# EAGLE schematic OpenDeck-r1 (EAGLE 6.5.0)
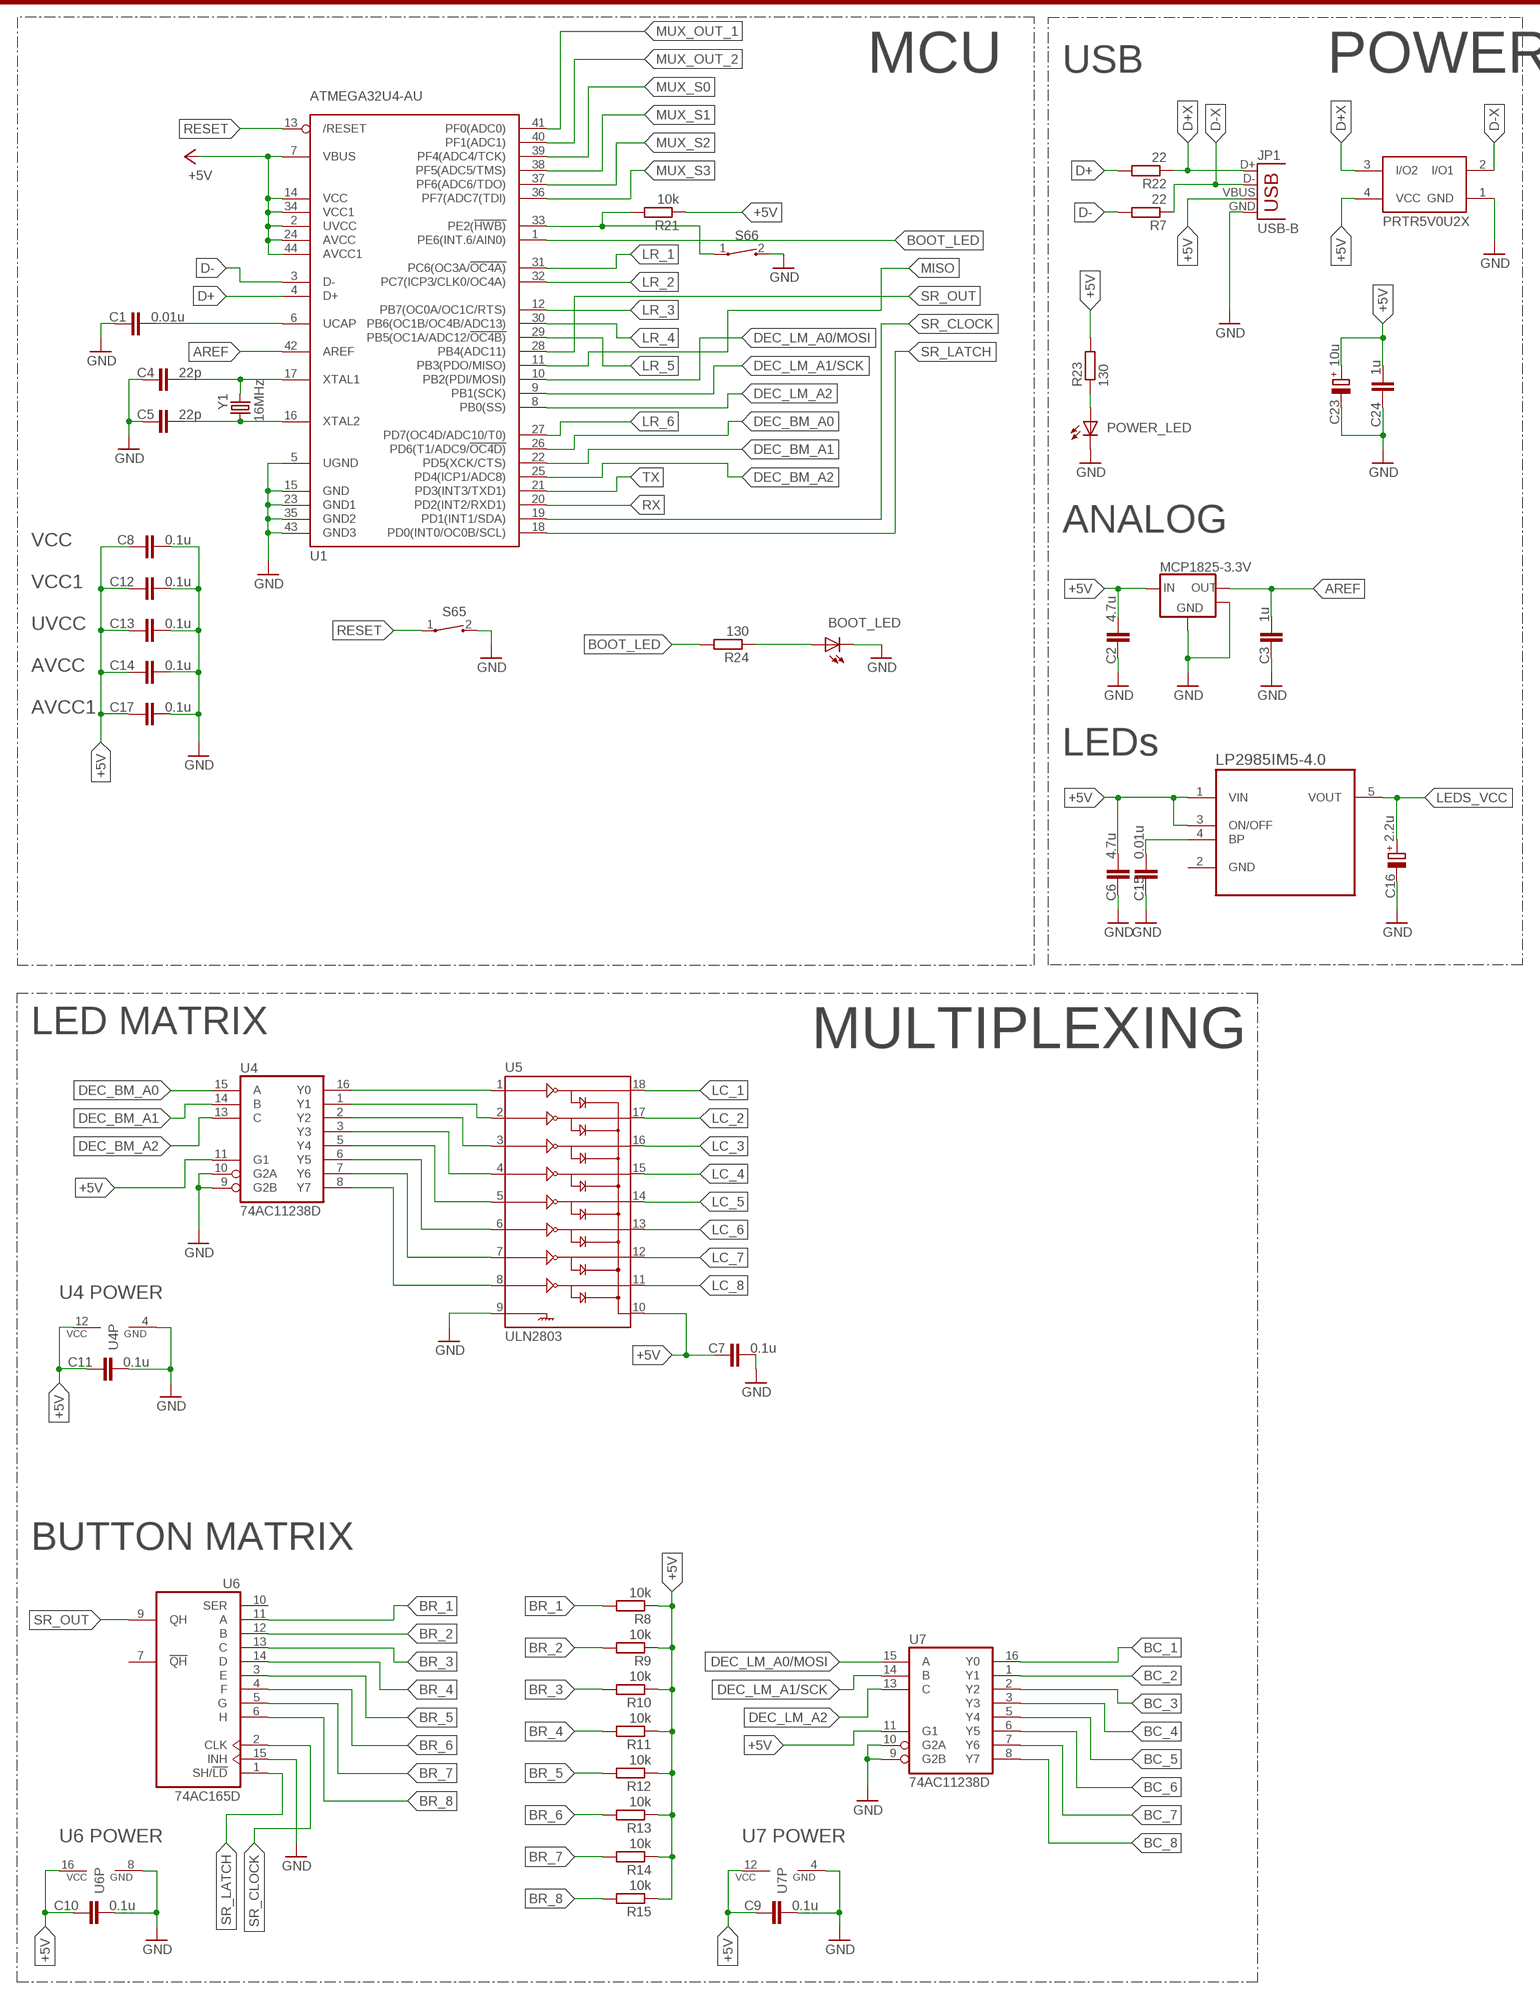
[diagram p0: schematic, sheet 1, part 1 of 2]
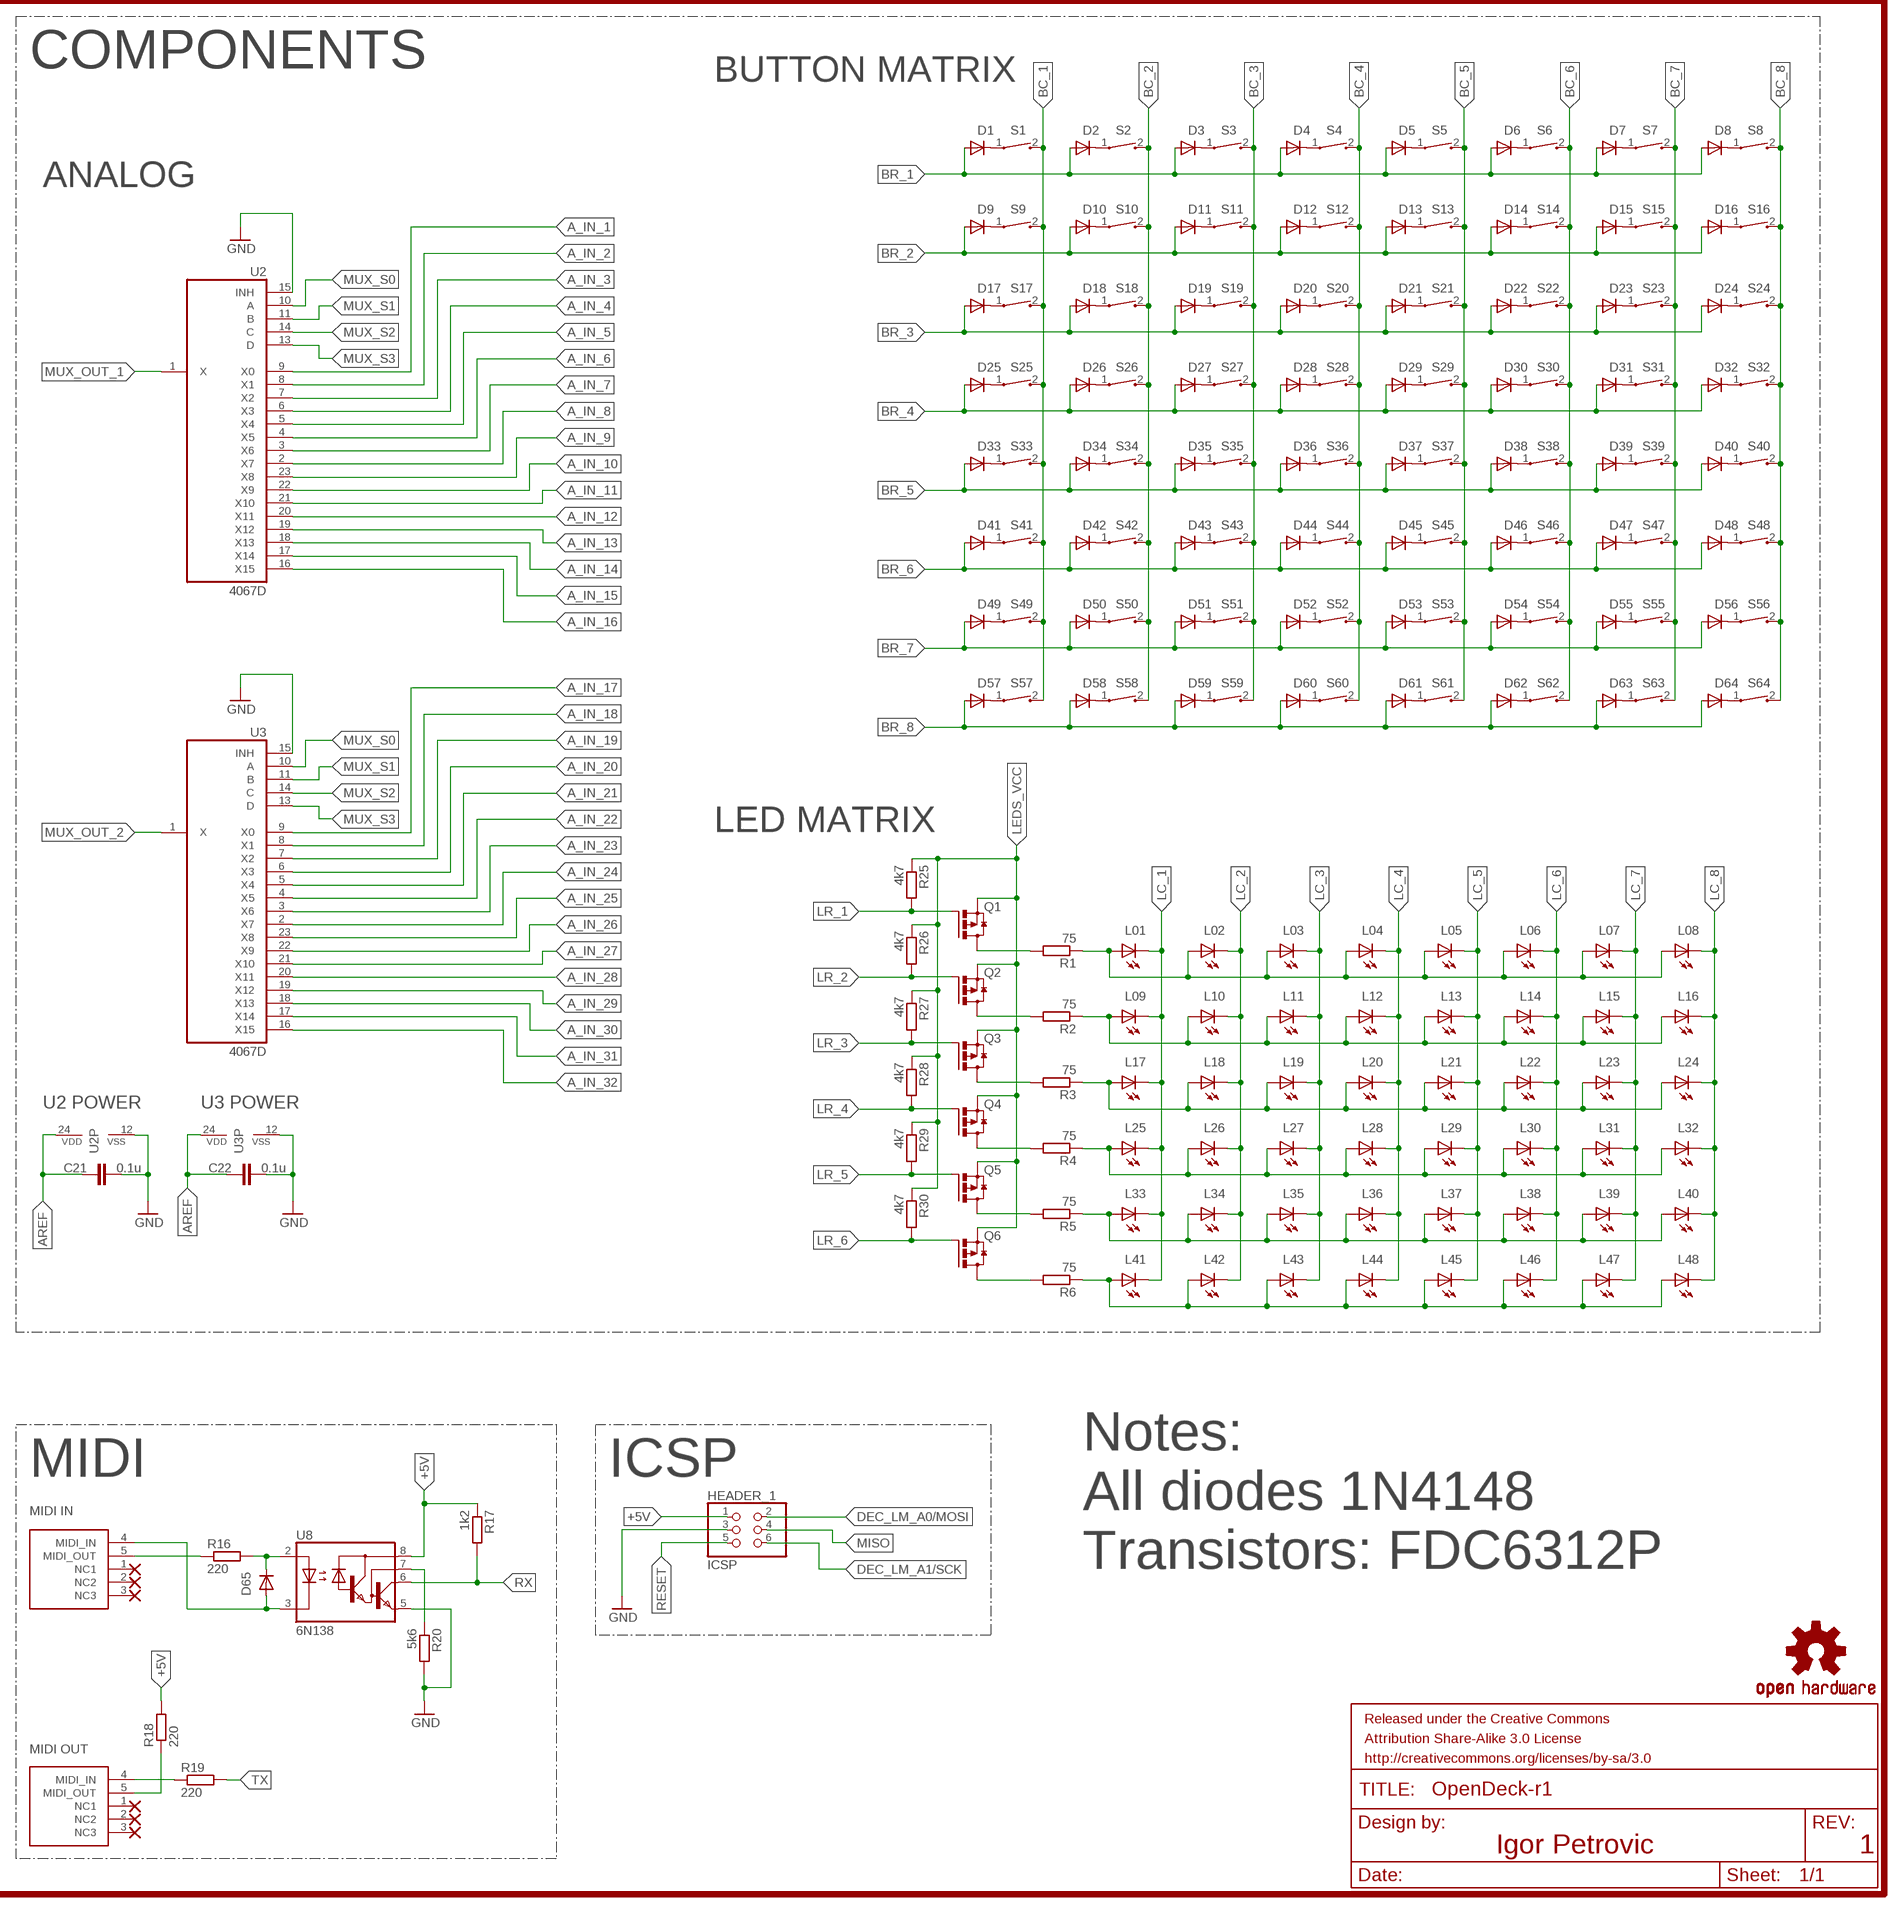
[diagram p1: schematic, sheet 1, part 2 of 2]

## Parts
BOOT_LED  LAW51M  [W51]
C1  0.01u  C-EU025-025X050  [C025-025X050]
C2  4.7u  C-EU025-025X050  [C025-025X050]
C3  1u  C-EU025-025X050  [C025-025X050]
C4  22p  C-EU025-025X050  [C025-025X050]
C5  22p  C-EU025-025X050  [C025-025X050]
C6  4.7u  C-EU025-025X050  [C025-025X050]
C7  0.1u  C-EU025-025X050  [C025-025X050]
C8  0.1u  C-EU025-025X050  [C025-025X050]
C9  0.1u  C-EU025-025X050  [C025-025X050]
C10  0.1u  C-EU025-025X050  [C025-025X050]
C11  0.1u  C-EU025-025X050  [C025-025X050]
C12  0.1u  C-EU025-025X050  [C025-025X050]
C13  0.1u  C-EU025-025X050  [C025-025X050]
C14  0.1u  C-EU025-025X050  [C025-025X050]
C15  0.01u  C-EU025-025X050  [C025-025X050]
C16  2.2u  CPOL-EUSMCB  [SMC_B]
C17  0.1u  C-EU025-025X050  [C025-025X050]
C21  0.1u  C-EU025-025X050  [C025-025X050]
C22  0.1u  C-EU025-025X050  [C025-025X050]
C23  10u  CPOL-EUSMCB  [SMC_B]
C24  1u  C-EU025-025X050  [C025-025X050]
D1  1N4148DO35-10  [DO35-10]
D2  1N4148DO35-10  [DO35-10]
D3  1N4148DO35-10  [DO35-10]
D4  1N4148DO35-10  [DO35-10]
D5  1N4148DO35-10  [DO35-10]
D6  1N4148DO35-10  [DO35-10]
D7  1N4148DO35-10  [DO35-10]
D8  1N4148DO35-10  [DO35-10]
D9  1N4148DO35-10  [DO35-10]
D10  1N4148DO35-10  [DO35-10]
D11  1N4148DO35-10  [DO35-10]
D12  1N4148DO35-10  [DO35-10]
D13  1N4148DO35-10  [DO35-10]
D14  1N4148DO35-10  [DO35-10]
D15  1N4148DO35-10  [DO35-10]
D16  1N4148DO35-10  [DO35-10]
D17  1N4148DO35-10  [DO35-10]
D18  1N4148DO35-10  [DO35-10]
D19  1N4148DO35-10  [DO35-10]
D20  1N4148DO35-10  [DO35-10]
D21  1N4148DO35-10  [DO35-10]
D22  1N4148DO35-10  [DO35-10]
D23  1N4148DO35-10  [DO35-10]
D24  1N4148DO35-10  [DO35-10]
D25  1N4148DO35-10  [DO35-10]
D26  1N4148DO35-10  [DO35-10]
D27  1N4148DO35-10  [DO35-10]
D28  1N4148DO35-10  [DO35-10]
D29  1N4148DO35-10  [DO35-10]
D30  1N4148DO35-10  [DO35-10]
D31  1N4148DO35-10  [DO35-10]
D32  1N4148DO35-10  [DO35-10]
D33  1N4148DO35-10  [DO35-10]
D34  1N4148DO35-10  [DO35-10]
D35  1N4148DO35-10  [DO35-10]
D36  1N4148DO35-10  [DO35-10]
D37  1N4148DO35-10  [DO35-10]
D38  1N4148DO35-10  [DO35-10]
D39  1N4148DO35-10  [DO35-10]
D40  1N4148DO35-10  [DO35-10]
D41  1N4148DO35-10  [DO35-10]
D42  1N4148DO35-10  [DO35-10]
D43  1N4148DO35-10  [DO35-10]
D44  1N4148DO35-10  [DO35-10]
D45  1N4148DO35-10  [DO35-10]
D46  1N4148DO35-10  [DO35-10]
D47  1N4148DO35-10  [DO35-10]
D48  1N4148DO35-10  [DO35-10]
D49  1N4148DO35-10  [DO35-10]
D50  1N4148DO35-10  [DO35-10]
D51  1N4148DO35-10  [DO35-10]
D52  1N4148DO35-10  [DO35-10]
D53  1N4148DO35-10  [DO35-10]
D54  1N4148DO35-10  [DO35-10]
D55  1N4148DO35-10  [DO35-10]
D56  1N4148DO35-10  [DO35-10]
D57  1N4148DO35-10  [DO35-10]
D58  1N4148DO35-10  [DO35-10]
D59  1N4148DO35-10  [DO35-10]
D60  1N4148DO35-10  [DO35-10]
D61  1N4148DO35-10  [DO35-10]
D62  1N4148DO35-10  [DO35-10]
D63  1N4148DO35-10  [DO35-10]
D64  1N4148DO35-10  [DO35-10]
D65  MBRA140  DIODESMA  [SMA-DIODE]
FRAME1  FRAME-LETTER  [CREATIVE_COMMONS]
HEADER_1  ICSP  PINHD-2X3  [2X03]
IN_CON  MIDI_CONN_FEMALE_SUPPORT  [DIN_5_FEMALE_SUPPORT]
JP1  USB-B  USBPTH  [USB-B-PTH]
L01  LAW51M  [W51]
L02  LAW51M  [W51]
L03  LAW51M  [W51]
L04  LAW51M  [W51]
L05  LAW51M  [W51]
L06  LAW51M  [W51]
L07  LAW51M  [W51]
L08  LAW51M  [W51]
L09  LAW51M  [W51]
L10  LAW51M  [W51]
L11  LAW51M  [W51]
L12  LAW51M  [W51]
L13  LAW51M  [W51]
L14  LAW51M  [W51]
L15  LAW51M  [W51]
L16  LAW51M  [W51]
L17  LAW51M  [W51]
L18  LAW51M  [W51]
L19  LAW51M  [W51]
L20  LAW51M  [W51]
L21  LAW51M  [W51]
L22  LAW51M  [W51]
L23  LAW51M  [W51]
L24  LAW51M  [W51]
L25  LAW51M  [W51]
L26  LAW51M  [W51]
L27  LAW51M  [W51]
L28  LAW51M  [W51]
L29  LAW51M  [W51]
L30  LAW51M  [W51]
L31  LAW51M  [W51]
L32  LAW51M  [W51]
L33  LAW51M  [W51]
L34  LAW51M  [W51]
L35  LAW51M  [W51]
L36  LAW51M  [W51]
L37  LAW51M  [W51]
L38  LAW51M  [W51]
L39  LAW51M  [W51]
L40  LAW51M  [W51]
L41  LAW51M  [W51]
L42  LAW51M  [W51]
L43  LAW51M  [W51]
L44  LAW51M  [W51]
L45  LAW51M  [W51]
L46  LAW51M  [W51]
L47  LAW51M  [W51]
L48  LAW51M  [W51]
MCP1825-3.3V  MCP1825_SOT223  [SOT-223-3]
OUT_CON  MIDI_CONN_FEMALE_SUPPORT  [DIN_5_FEMALE_SUPPORT]
POWER_LED  LAW51M  [W51]
PRTR5V0U2X  PRTR5V0U2X  [SOT-143B]
Q1  FDN360P  [SUPER-SOT3]
Q2  FDN360P  [SUPER-SOT3]
Q3  FDN360P  [SUPER-SOT3]
Q4  FDN360P  [SUPER-SOT3]
Q5  FDN360P  [SUPER-SOT3]
Q6  FDN360P  [SUPER-SOT3]
R1  75  R-EU_0204/7  [0204/7]
R2  75  R-EU_0204/7  [0204/7]
R3  75  R-EU_0204/7  [0204/7]
R4  75  R-EU_0204/7  [0204/7]
R5  75  R-EU_0204/7  [0204/7]
R6  75  R-EU_0204/7  [0204/7]
R7  22  R-EU_0204/7  [0204/7]
R8  10k  R-EU_0204/7  [0204/7]
R9  10k  R-EU_0204/7  [0204/7]
R10  10k  R-EU_0204/7  [0204/7]
R11  10k  R-EU_0204/7  [0204/7]
R12  10k  R-EU_0204/7  [0204/7]
R13  10k  R-EU_0204/7  [0204/7]
R14  10k  R-EU_0204/7  [0204/7]
R15  10k  R-EU_0204/7  [0204/7]
R16  220  R-EU_0204/7  [0204/7]
R17  1k2  R-EU_0204/7  [0204/7]
R18  220  R-EU_0204/7  [0204/7]
R19  220  R-EU_0204/7  [0204/7]
R20  5k6  R-EU_0204/7  [0204/7]
R21  10k  R-EU_0204/7  [0204/7]
R22  22  R-EU_0204/7  [0204/7]
R23  130  R-EU_0204/7  [0204/7]
R24  130  R-EU_0204/7  [0204/7]
R25  4k7  R-EU_0204/7  [0204/7]
R26  4k7  R-EU_0204/7  [0204/7]
R27  4k7  R-EU_0204/7  [0204/7]
R28  4k7  R-EU_0204/7  [0204/7]
R29  4k7  R-EU_0204/7  [0204/7]
R30  4k7  R-EU_0204/7  [0204/7]
S1  CT10-XXXX-A2  [CT10-XXXX-A2]
S2  CT10-XXXX-A2  [CT10-XXXX-A2]
S3  CT10-XXXX-A2  [CT10-XXXX-A2]
S4  CT10-XXXX-A2  [CT10-XXXX-A2]
S5  CT10-XXXX-A2  [CT10-XXXX-A2]
S6  CT10-XXXX-A2  [CT10-XXXX-A2]
S7  CT10-XXXX-A2  [CT10-XXXX-A2]
S8  CT10-XXXX-A2  [CT10-XXXX-A2]
S9  CT10-XXXX-A2  [CT10-XXXX-A2]
S10  CT10-XXXX-A2  [CT10-XXXX-A2]
S11  CT10-XXXX-A2  [CT10-XXXX-A2]
S12  CT10-XXXX-A2  [CT10-XXXX-A2]
S13  CT10-XXXX-A2  [CT10-XXXX-A2]
S14  CT10-XXXX-A2  [CT10-XXXX-A2]
S15  CT10-XXXX-A2  [CT10-XXXX-A2]
S16  CT10-XXXX-A2  [CT10-XXXX-A2]
S17  CT10-XXXX-A2  [CT10-XXXX-A2]
S18  CT10-XXXX-A2  [CT10-XXXX-A2]
S19  CT10-XXXX-A2  [CT10-XXXX-A2]
S20  CT10-XXXX-A2  [CT10-XXXX-A2]
S21  CT10-XXXX-A2  [CT10-XXXX-A2]
S22  CT10-XXXX-A2  [CT10-XXXX-A2]
S23  CT10-XXXX-A2  [CT10-XXXX-A2]
S24  CT10-XXXX-A2  [CT10-XXXX-A2]
S25  CT10-XXXX-A2  [CT10-XXXX-A2]
S26  CT10-XXXX-A2  [CT10-XXXX-A2]
S27  CT10-XXXX-A2  [CT10-XXXX-A2]
S28  CT10-XXXX-A2  [CT10-XXXX-A2]
S29  CT10-XXXX-A2  [CT10-XXXX-A2]
S30  CT10-XXXX-A2  [CT10-XXXX-A2]
S31  CT10-XXXX-A2  [CT10-XXXX-A2]
S32  CT10-XXXX-A2  [CT10-XXXX-A2]
S33  CT10-XXXX-A2  [CT10-XXXX-A2]
S34  CT10-XXXX-A2  [CT10-XXXX-A2]
S35  CT10-XXXX-A2  [CT10-XXXX-A2]
S36  CT10-XXXX-A2  [CT10-XXXX-A2]
S37  CT10-XXXX-A2  [CT10-XXXX-A2]
S38  CT10-XXXX-A2  [CT10-XXXX-A2]
S39  CT10-XXXX-A2  [CT10-XXXX-A2]
S40  CT10-XXXX-A2  [CT10-XXXX-A2]
S41  CT10-XXXX-A2  [CT10-XXXX-A2]
S42  CT10-XXXX-A2  [CT10-XXXX-A2]
S43  CT10-XXXX-A2  [CT10-XXXX-A2]
S44  CT10-XXXX-A2  [CT10-XXXX-A2]
S45  CT10-XXXX-A2  [CT10-XXXX-A2]
S46  CT10-XXXX-A2  [CT10-XXXX-A2]
S47  CT10-XXXX-A2  [CT10-XXXX-A2]
S48  CT10-XXXX-A2  [CT10-XXXX-A2]
S49  CT10-XXXX-A2  [CT10-XXXX-A2]
S50  CT10-XXXX-A2  [CT10-XXXX-A2]
S51  CT10-XXXX-A2  [CT10-XXXX-A2]
S52  CT10-XXXX-A2  [CT10-XXXX-A2]
S53  CT10-XXXX-A2  [CT10-XXXX-A2]
S54  CT10-XXXX-A2  [CT10-XXXX-A2]
S55  CT10-XXXX-A2  [CT10-XXXX-A2]
S56  CT10-XXXX-A2  [CT10-XXXX-A2]
S57  CT10-XXXX-A2  [CT10-XXXX-A2]
S58  CT10-XXXX-A2  [CT10-XXXX-A2]
S59  CT10-XXXX-A2  [CT10-XXXX-A2]
S60  CT10-XXXX-A2  [CT10-XXXX-A2]
S61  CT10-XXXX-A2  [CT10-XXXX-A2]
S62  CT10-XXXX-A2  [CT10-XXXX-A2]
S63  CT10-XXXX-A2  [CT10-XXXX-A2]
S64  CT10-XXXX-A2  [CT10-XXXX-A2]
S65  CT10-XXXX-A2  [CT10-XXXX-A2]
S66  CT10-XXXX-A2  [CT10-XXXX-A2]
U1  ATMEGA32U4-AU  [TQFP44]
U2  4067D  [SO24W]
U3  4067D  [SO24W]
U4  74AC11238D  [SO16]
U5  ULN2803  ULN2803DIP  [DIL18]
U6  74AC165D  [SO16]
U7  74AC11238D  [SO16]
U8  6N138  [DIL08]
U9  LP2985IM5-4.0  [SOT95P284X120-5N]
U$3  OSHW-LOGOS  [OSHW-LOGO-S]
Y1  16MHz  CRYSTALHC49US  [HC49US]

## Nets
56: D65.C R16.2 U8.2(A)
1235: OUT_CON.5(MIDI_OUT) R18.1
+5V [vcc]: C2.1 C6.1 C7.1 C8.1 C9.1 C10.1 C11.1 C12.1 C13.1 C14.1 C17.1 C23.+ C24.1 HEADER_1.1 JP1.VBUS MCP1825-3.3V.1(VIN) PRTR5V0U2X.4(VCC) R8.1 R9.1 R10.1 R11.1 R12.1 R13.1 R14.1 R15.1 R17.1 R18.2 R21.1 R23.2 U1.2(UVCC) U1.7(VBUS) U1.14(VCC) U1.24(AVCC) U1.34(VCC1) U1.44(AVCC1) U4.11(G1) U4.12(VCC) U5.10 U6.16(VCC) U7.11(G1) U7.12(VCC) U8.8(VCC) U9.1(VIN) U9.3(ON/OFF)
A_IN_1: U2.9(X0)
A_IN_2: U2.8(X1)
A_IN_3: U2.7(X2)
A_IN_4: U2.6(X3)
A_IN_5: U2.5(X4)
A_IN_6: U2.4(X5)
A_IN_7: U2.3(X6)
A_IN_8: U2.2(X7)
A_IN_9: U2.23(X8)
A_IN_10: U2.22(X9)
A_IN_11: U2.21(X10)
A_IN_12: U2.20(X11)
A_IN_13: U2.19(X12)
A_IN_14: U2.18(X13)
A_IN_15: U2.17(X14)
A_IN_16: U2.16(X15)
A_IN_17: U3.9(X0)
A_IN_18: U3.8(X1)
A_IN_19: U3.7(X2)
A_IN_20: U3.6(X3)
A_IN_21: U3.5(X4)
A_IN_22: U3.4(X5)
A_IN_23: U3.3(X6)
A_IN_24: U3.2(X7)
A_IN_25: U3.23(X8)
A_IN_26: U3.22(X9)
A_IN_27: U3.21(X10)
A_IN_28: U3.20(X11)
A_IN_29: U3.19(X12)
A_IN_30: U3.18(X13)
A_IN_31: U3.17(X14)
A_IN_32: U3.16(X15)
AREF: C3.1 C21.2 C22.2 MCP1825-3.3V.3(VOUT) U1.42(AREF) U2.24(VDD) U3.24(VDD)
BC_1: S1.2 S9.2 S17.2 S25.2 S33.2 S41.2 S49.2 S57.2 U7.16(Y0)
BC_2: S2.2 S10.2 S18.2 S26.2 S34.2 S42.2 S50.2 S58.2 U7.1(Y1)
BC_3: S3.2 S11.2 S19.2 S27.2 S35.2 S43.2 S51.2 S59.2 U7.2(Y2)
BC_4: S4.2 S12.2 S20.2 S28.2 S36.2 S44.2 S52.2 S60.2 U7.3(Y3)
BC_5: S5.2 S13.2 S21.2 S29.2 S37.2 S45.2 S53.2 S61.2 U7.5(Y4)
BC_6: S6.2 S14.2 S22.2 S30.2 S38.2 S46.2 S54.2 S62.2 U7.6(Y5)
BC_7: S7.2 S15.2 S23.2 S31.2 S39.2 S47.2 S55.2 S63.2 U7.7(Y6)
BC_8: S8.2 S16.2 S24.2 S32.2 S40.2 S48.2 S56.2 S64.2 U7.8(Y7)
BOOT_LED: R24.2 U1.1(PE6(INT.6/AIN0))
BR_1: D1.A D2.A D3.A D4.A D5.A D6.A D7.A D8.A R8.2 U6.11(A)
BR_2: D9.A D10.A D11.A D12.A D13.A D14.A D15.A D16.A R9.2 U6.12(B)
BR_3: D17.A D18.A D19.A D20.A D21.A D22.A D23.A D24.A R10.2 U6.13(C)
BR_4: D25.A D26.A D27.A D28.A D29.A D30.A D31.A D32.A R11.2 U6.14(D)
BR_5: D33.A D34.A D35.A D36.A D37.A D38.A D39.A D40.A R12.2 U6.3(E)
BR_6: D41.A D42.A D43.A D44.A D45.A D46.A D47.A D48.A R13.2 U6.4(F)
BR_7: D49.A D50.A D51.A D52.A D53.A D54.A D55.A D56.A R14.2 U6.5(G)
BR_8: D57.A D58.A D59.A D60.A D61.A D62.A D63.A D64.A R15.2 U6.6(H)
D+: R22.2 U1.4(D+)
D+X: JP1.D+ PRTR5V0U2X.3(I/O2) R22.1
D-: R7.2 U1.3(D-)
D-X: JP1.D- PRTR5V0U2X.2(I/O1) R7.1
DEC_BM_A0: U1.26(PD6(T1/ADC9/!OC4D)) U4.15(A)
DEC_BM_A1: U1.22(PD5(XCK/CTS)) U4.14(B)
DEC_BM_A2: U1.25(PD4(ICP1/ADC8)) U4.13(C)
DEC_LM_A0/MOSI: HEADER_1.2 U1.10(PB2(PDI/MOSI)) U7.15(A)
DEC_LM_A1/SCK: HEADER_1.6 U1.9(PB1(SCK)) U7.14(B)
DEC_LM_A2: U1.8(PB0(SS)) U7.13(C)
DECODER_OUT_1: U4.16(Y0) U5.1
DECODER_OUT_2: U4.1(Y1) U5.2
DECODER_OUT_3: U4.2(Y2) U5.3
DECODER_OUT_4: U4.3(Y3) U5.4
DECODER_OUT_5: U4.5(Y4) U5.5
DECODER_OUT_6: U4.6(Y5) U5.6
DECODER_OUT_7: U4.7(Y6) U5.7
DECODER_OUT_8: U4.8(Y7) U5.8
GND: BOOT_LED.C C1.2 C2.2 C3.2 C4.1 C5.1 C6.2 C7.2 C8.2 C9.2 C10.2 C11.2 C12.2 C13.2 C14.2 C15.2 C16.- C17.2 C21.1 C22.1 C23.- C24.2 HEADER_1.3 JP1.GND MCP1825-3.3V.2(GND) MCP1825-3.3V.4(HEATSINK) POWER_LED.C PRTR5V0U2X.1(GND) R20.2 S65.2 S66.2 U1.5(UGND) U1.15(GND) U1.23(GND1) U1.35(GND2) U1.43(GND3) U2.12(VSS) U2.15(INH) U3.12(VSS) U3.15(INH) U4.4(GND) U4.9(G2B) U4.10(G2A) U5.9 U6.8(GND) U6.15(INH) U7.4(GND) U7.9(G2B) U7.10(G2A) U8.5(GND)
L_ROW_1: L01.A L02.A L03.A L04.A L05.A L06.A L07.A L08.A R1.1
L_ROW_2: L09.A L10.A L11.A L12.A L13.A L14.A L15.A L16.A R2.1
L_ROW_3: L25.A L26.A L27.A L28.A L29.A L30.A L31.A L32.A R4.1
L_ROW_4: L33.A L34.A L35.A L36.A L37.A L38.A L39.A L40.A R5.1
L_ROW_5: L41.A L42.A L43.A L44.A L45.A L46.A L47.A L48.A R6.1
LC_1: L01.C L09.C L17.C L25.C L33.C L41.C U5.18
LC_2: L02.C L10.C L18.C L26.C L34.C L42.C U5.17
LC_3: L03.C L11.C L19.C L27.C L35.C L43.C U5.16
LC_4: L04.C L12.C L20.C L28.C L36.C L44.C U5.15
LC_5: L05.C L13.C L21.C L29.C L37.C L45.C U5.14
LC_6: L06.C L14.C L22.C L30.C L38.C L46.C U5.13
LC_7: L07.C L15.C L23.C L31.C L39.C L47.C U5.12
LC_8: L08.C L16.C L24.C L32.C L40.C L48.C U5.11
LEDS_VCC: C16.+ Q1.2(S) Q2.2(S) Q3.2(S) Q4.2(S) Q5.2(S) Q6.2(S) R25.1 R26.1 R27.1 R28.1 R29.1 R30.1 U9.5(VOUT)
LR_1: Q1.1(G) R25.2 U1.31(PC6(OC3A/!OC4A))
LR_2: Q2.1(G) R26.2 U1.32(PC7(ICP3/CLK0/OC4A))
LR_3: Q3.1(G) R27.2 U1.12(PB7(OC0A/OC1C/RTS))
LR_4: Q4.1(G) R28.2 U1.30(PB6(OC1B/OC4B/ADC13))
LR_5: Q5.1(G) R29.2 U1.29(PB5(OC1A/ADC12/!OC4B))
LR_6: Q6.1(G) R30.2 U1.27(PD7(OC4D/ADC10/T0))
MISO: HEADER_1.4 U1.11(PB3(PDO/MISO))
MUX_OUT_1: U1.41(PF0(ADC0)) U2.1(X)
MUX_OUT_2: U1.40(PF1(ADC1)) U3.1(X)
MUX_S0: U1.39(PF4(ADC4/TCK)) U2.10(A) U3.10(A)
MUX_S1: U1.38(PF5(ADC5/TMS)) U2.11(B) U3.11(B)
MUX_S2: U1.37(PF6(ADC6/TDO)) U2.14(C) U3.14(C)
MUX_S3: U1.36(PF7(ADC7(TDI)) U2.13(D) U3.13(D)
N$1: D34.C S34.1
N$2: D15.C S15.1
N$3: D35.C S35.1
N$4: D36.C S36.1
N$5: L17.A L18.A L19.A L20.A L21.A L22.A L23.A L24.A R3.1
N$6: C15.1 U9.4(BP)
N$7: R20.1 U8.7(VB)
N$8: OUT_CON.4(MIDI_IN) R19.1
N$9: D39.C S39.1
N$10: D40.C S40.1
N$11: D9.C S9.1
N$12: D10.C S10.1
N$13: D11.C S11.1
N$14: D12.C S12.1
N$15: D41.C S41.1
N$16: D14.C S14.1
N$17: D42.C S42.1
N$18: D16.C S16.1
N$19: D43.C S43.1
N$20: D44.C S44.1
N$21: D46.C S46.1
N$22: D47.C S47.1
N$23: D48.C S48.1
N$24: D6.C S6.1
N$25: D13.C S13.1
N$26: D49.C S49.1
N$27: D5.C S5.1
N$28: IN_CON.5(MIDI_OUT) R16.1
N$29: D17.C S17.1
N$30: D18.C S18.1
N$31: D50.C S50.1
N$32: D19.C S19.1
N$33: D51.C S51.1
N$34: D20.C S20.1
N$35: D21.C S21.1
N$36: D22.C S22.1
N$37: D23.C S23.1
N$38: D1.C S1.1
N$39: D24.C S24.1
N$40: D52.C S52.1
N$41: D53.C S53.1
N$42: D54.C S54.1
N$43: D55.C S55.1
N$44: D56.C S56.1
N$45: D57.C S57.1
N$46: D58.C S58.1
N$47: D59.C S59.1
N$48: D60.C S60.1
N$49: D61.C S61.1
N$50: D62.C S62.1
N$51: D63.C S63.1
N$52: D25.C S25.1
N$53: D26.C S26.1
N$54: D27.C S27.1
N$55: D28.C S28.1
N$56: D29.C S29.1
N$57: D64.C S64.1
N$58: D30.C S30.1
N$59: D31.C S31.1
N$60: D32.C S32.1
N$61: D38.C S38.1
N$62: D45.C S45.1
N$63: D37.C S37.1
N$64: D2.C S2.1
N$65: D33.C S33.1
N$66: D3.C S3.1
N$67: D4.C S4.1
N$68: C1.1 U1.6(UCAP)
N$69: C4.2 U1.17(XTAL1) Y1.2
N$70: C5.2 U1.16(XTAL2) Y1.1
N$71: D7.C S7.1
N$72: D8.C S8.1
N$75: POWER_LED.A R23.1
N$76: BOOT_LED.A R24.1
N$77 [vcc]: R21.2 S66.1 U1.33(PE2(!HWB))
N$79: Q1.3(D) R1.2
N$80: Q2.3(D) R2.2
N$81: Q3.3(D) R3.2
N$82: Q4.3(D) R4.2
N$83: Q5.3(D) R5.2
N$86: Q6.3(D) R6.2
PIN5: D65.A IN_CON.4(MIDI_IN) U8.3(C)
RESET: HEADER_1.5 S65.1 U1.13(/RESET)
RX: R17.2 U1.20(PD2(INT2/RXD1)) U8.6(VO)
SR_CLOCK: U1.19(PD1(INT1/SDA)) U6.2(CLK)
SR_LATCH: U1.18(PD0(INT0/OC0B/SCL)) U6.1(SH/!LD)
SR_OUT: U1.28(PB4(ADC11)) U6.9(QH)
TX: R19.2 U1.21(PD3(INT3/TXD1))
Unconnected: BOOT_LED.TH@1(TH) BOOT_LED.TH@2(TH) BOOT_LED.TH@3(TH) IN_CON.1(NC1) IN_CON.2(NC2) IN_CON.3(NC3) L01.TH@1(TH) L01.TH@2(TH) L01.TH@3(TH) L02.TH@1(TH) L02.TH@2(TH) L02.TH@3(TH) L03.TH@1(TH) L03.TH@2(TH) L03.TH@3(TH) L04.TH@1(TH) L04.TH@2(TH) L04.TH@3(TH) L05.TH@1(TH) L05.TH@2(TH) L05.TH@3(TH) L06.TH@1(TH) L06.TH@2(TH) L06.TH@3(TH) L07.TH@1(TH) L07.TH@2(TH) L07.TH@3(TH) L08.TH@1(TH) L08.TH@2(TH) L08.TH@3(TH) L09.TH@1(TH) L09.TH@2(TH) L09.TH@3(TH) L10.TH@1(TH) L10.TH@2(TH) L10.TH@3(TH) L11.TH@1(TH) L11.TH@2(TH) L11.TH@3(TH) L12.TH@1(TH) L12.TH@2(TH) L12.TH@3(TH) L13.TH@1(TH) L13.TH@2(TH) L13.TH@3(TH) L14.TH@1(TH) L14.TH@2(TH) L14.TH@3(TH) L15.TH@1(TH) L15.TH@2(TH) L15.TH@3(TH) L16.TH@1(TH) L16.TH@2(TH) L16.TH@3(TH) L17.TH@1(TH) L17.TH@2(TH) L17.TH@3(TH) L18.TH@1(TH) L18.TH@2(TH) L18.TH@3(TH) L19.TH@1(TH) L19.TH@2(TH) L19.TH@3(TH) L20.TH@1(TH) L20.TH@2(TH) L20.TH@3(TH) L21.TH@1(TH) L21.TH@2(TH) L21.TH@3(TH) L22.TH@1(TH) L22.TH@2(TH) L22.TH@3(TH) L23.TH@1(TH) L23.TH@2(TH) L23.TH@3(TH) L24.TH@1(TH) L24.TH@2(TH) L24.TH@3(TH) L25.TH@1(TH) L25.TH@2(TH) L25.TH@3(TH) L26.TH@1(TH) L26.TH@2(TH) L26.TH@3(TH) L27.TH@1(TH) L27.TH@2(TH) L27.TH@3(TH) L28.TH@1(TH) L28.TH@2(TH) L28.TH@3(TH) L29.TH@1(TH) L29.TH@2(TH) L29.TH@3(TH) L30.TH@1(TH) L30.TH@2(TH) L30.TH@3(TH) L31.TH@1(TH) L31.TH@2(TH) L31.TH@3(TH) L32.TH@1(TH) L32.TH@2(TH) L32.TH@3(TH) L33.TH@1(TH) L33.TH@2(TH) L33.TH@3(TH) L34.TH@1(TH) L34.TH@2(TH) L34.TH@3(TH) L35.TH@1(TH) L35.TH@2(TH) L35.TH@3(TH) L36.TH@1(TH) L36.TH@2(TH) L36.TH@3(TH) L37.TH@1(TH) L37.TH@2(TH) L37.TH@3(TH) L38.TH@1(TH) L38.TH@2(TH) L38.TH@3(TH) L39.TH@1(TH) L39.TH@2(TH) L39.TH@3(TH) L40.TH@1(TH) L40.TH@2(TH) L40.TH@3(TH) L41.TH@1(TH) L41.TH@2(TH) L41.TH@3(TH) L42.TH@1(TH) L42.TH@2(TH) L42.TH@3(TH) L43.TH@1(TH) L43.TH@2(TH) L43.TH@3(TH) L44.TH@1(TH) L44.TH@2(TH) L44.TH@3(TH) L45.TH@1(TH) L45.TH@2(TH) L45.TH@3(TH) L46.TH@1(TH) L46.TH@2(TH) L46.TH@3(TH) L47.TH@1(TH) L47.TH@2(TH) L47.TH@3(TH) L48.TH@1(TH) L48.TH@2(TH) L48.TH@3(TH) OUT_CON.1(NC1) OUT_CON.2(NC2) OUT_CON.3(NC3) POWER_LED.TH@1(TH) POWER_LED.TH@2(TH) POWER_LED.TH@3(TH) U6.7(!QH) U6.10(SER) U9.2(GND)

## Notes on the sheet
- MCU | USB | POWER | COMPONENTS
- BUTTON MATRIX
- ANALOG
- ANALOG
- VCC
- VCC1
- UVCC
- AVCC
- AVCC1
- LEDs
- LED MATRIX
- LED MATRIX
- MULTIPLEXING
- U2 POWER | U3 POWER
- U4 POWER
- BUTTON MATRIX
- MIDI | ICSP
- MIDI IN
- Notes:
  All diodes 1N4148
  Transistors: FDC6312P
- U6 POWER | U7 POWER
- MIDI OUT
- Igor Petrovic | 1

## Library data of the parts
BOOT_LED L01-L09 L10-L48 POWER_LED = led:*W51M: Golden DRAGON® with Lens Enhanced Thinfilm LED Source: LA_LR_LY_W51M_Pb_free[1].pdf
C1-C15 C17 C21 C22 C24 = rcl:C-EU: CAPACITOR, European symbol
C16 C23 = rcl:CPOL-EU: POLARIZED CAPACITOR, European symbol
D1-D64 = diode:1N4148: DIODE high speed (Philips)
D65 = SparkFun:DIODE: Diode These are standard reverse protection diodes and small signal diodes. SMA package can handle up to about 1A. SOD-323 can handle about 200mA. What the SOD-323 package when ordering, there are some mfgs out there that are 5-pin packages.
FRAME1 = SparkFun-Aesthetics:FRAME-LETTER: Schematic Frame Standard 8.5x11 US Letter frame
HEADER_1 = pinhead:PINHD-2X3: PIN HEADER
IN_CON OUT_CON = SparkFun:MIDI_CONN_FEMALE_SUPPORT
JP1 = SparkFun-Connectors_original:USB: USB Connectors USB-B-PTH is fully proven SKU : PRT-00139/CONN-08278 USB-miniB is fully proven SKU : PRT-00587 USB-A-PCB is untested. USB-A-H is throughly reviewed, but untested. Spark Fun Electronics SKU : PRT-00437 USB-B-SMT is throughly reviewed, but untested. Needs silkscreen touching up. USB-A-S has not been used/tested USB-MB-H has not been used/tested USB-MICROB has been used. CONN-09505; PROD_ID: CONN-08278
MCP1825-3.3V = bt_regulator:MCP1825: Microchip MCP1824 LDO Voltage Regulator The MCP1825/MCP1825S is a 500 mA Low Dropout (LDO) linear regulator that provides high current and low output voltages. Datasheet.pdf <http://ww1.microchip.com/downloads/en/DeviceDoc/22056b.pdf>
PRTR5V0U2X = PRTR5V0U2X:PRTR5V0U2X
Q1-Q6 = transistor-power:FDN360P: Single P-Channel, PowerTrench (R) MOSFET Source: http://www.fairchildsemi.com/ds/FD/FDN360P.pdf
R1-R30 = rcl:R-EU_: RESISTOR, European symbol
S1-S66 = switch-coto:CT10-XXXX-: CT10 Series Molded Switch Source: www.cotorelay.com .. Coto_Technology__CT10-1530-G1.pdf
U1 = adafruit:ATMEGA32U4: http://www.ladyada.net/library/eagle
U2 U3 = 40xx:4067: 16-channel ANALOG MULTIPLEXER
U4 U7 = 74ac-logic:74AC11238: 3 to 8 line DECODER/DEMULTIPLEXER
U5 = SparkFun-PowerIC:ULN2803: Darlington Driver ULN2803 Darlington array. 500mA max per channel, 8-channel package. Spark Fun Electronics SKU : COM-00312
U6 = 74xx-eu:74*165: 8-bit parallel load SHIFT REGISTER
U8 = optocoupler:6N138: MOTOROLA OPTO COUPLER; MF: VISHAY/TELEFUNKEN; MPN: 6N138; OC_FARNELL: 9860150; OC_NEWARK: 35K5294
U9 = NSC_By_element14_Batch_1.1:LP2985IM5-4.0: Low-Dropout Regulator; MPN: LP2985IM5-4.0; OC_FARNELL: 1685683; OC_NEWARK: 41K6956; PACKAGE: SOT23-5; SUPPLIER: National Semiconductor
U$3 = SparkFun:OSHW-LOGO: Open Source Hardware Logo This logo indicates the piece of hardware it is found on incorporates a OSHW license and/or adheres to the definition of open source hardware found here: http://freedomdefined.org/OSHW
Y1 = SparkFun-FreqCtrl:CRYSTAL: Various standard crystals. Proven footprints.

## Net classes
0 default: width 0.203 mm
1 vcc: width 0.254 mm